# EAGLE design untitled (EAGLE 9.2.2)
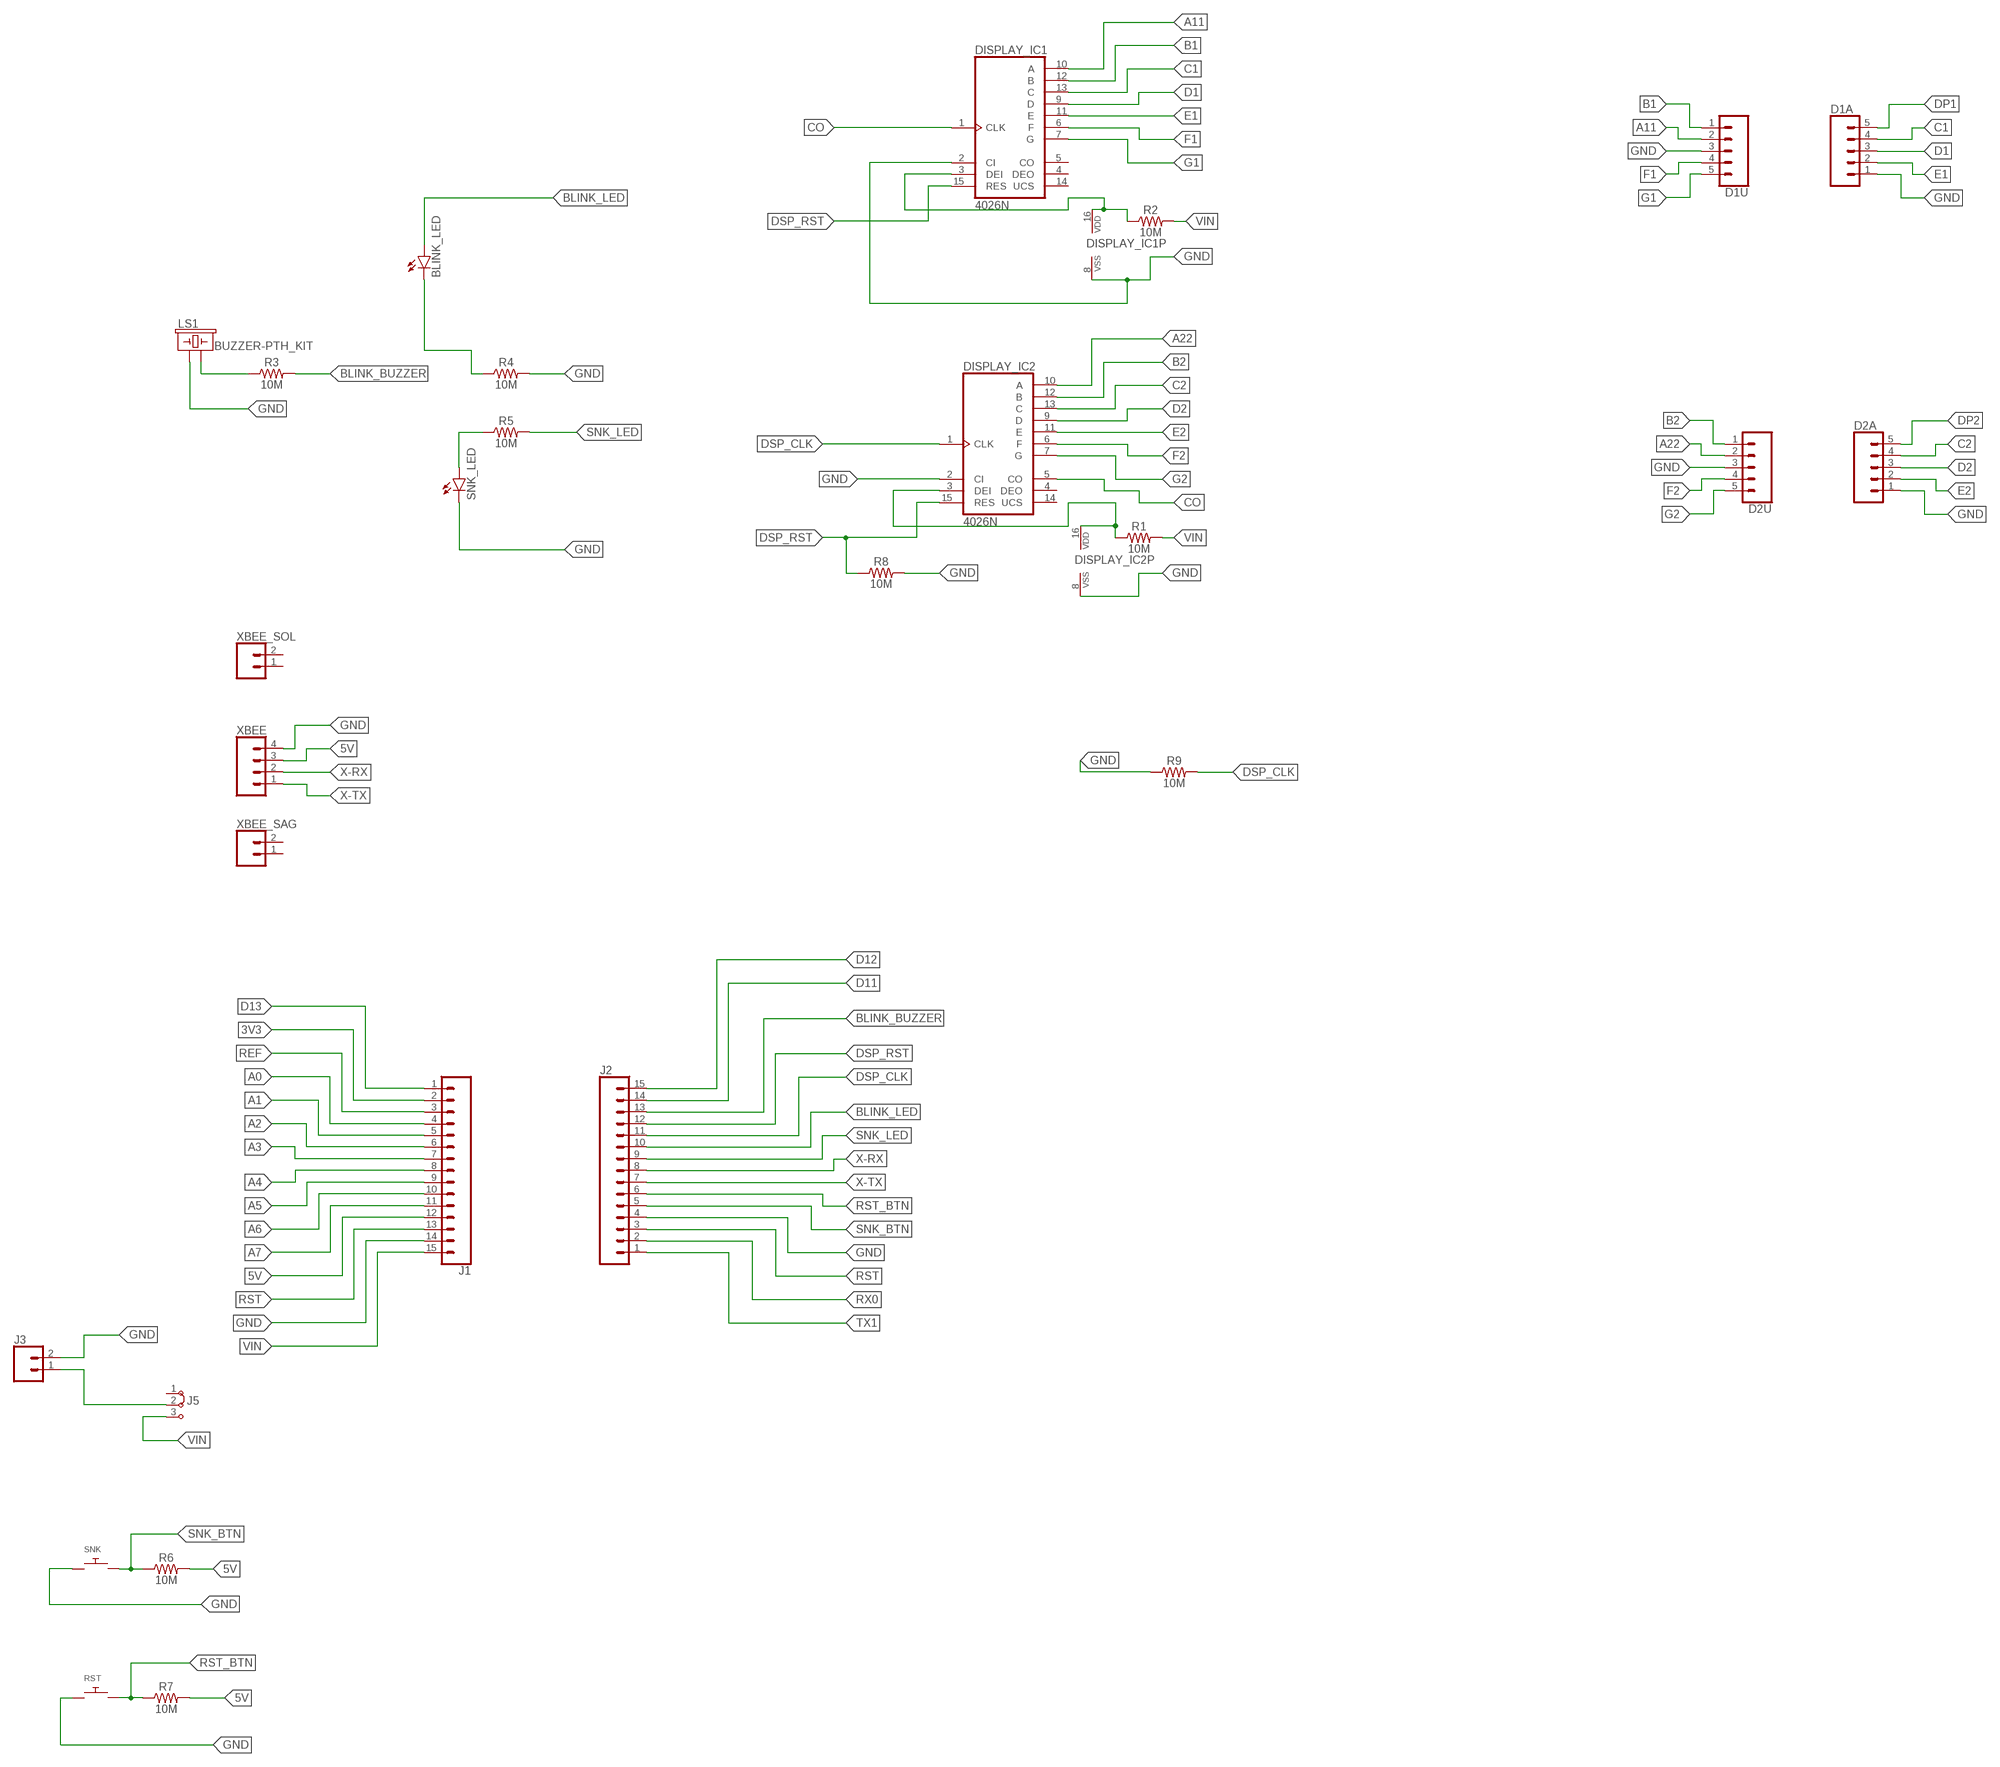
[diagram p0: schematic, sheet 1]

## Parts
BLINK_LED  LED5MM  [LED5MM]
D1A  CONN_05  [1X05]
D1U  CONN_05  [1X05]
D2A  CONN_05  [1X05]
D2U  CONN_05  [1X05]
DISPLAY_IC1  4026N  [DIL16]
DISPLAY_IC2  4026N  [DIL16]
J1  CONN_15  [1X15]
J2  CONN_15  [1X15]
J3  CONN_025MM  [SCREWTERMINAL-5MM-2]
J5  J2X2MM  [04C]
LS1  BUZZER-PTH_KIT  [BUZZER-12MM-KIT]
R1  10M  10MOHM-HORIZ-1/4W-5%  [AXIAL-0.3]
R2  10M  10MOHM-HORIZ-1/4W-5%  [AXIAL-0.3]
R3  10M  10MOHM-HORIZ-1/4W-5%  [AXIAL-0.3]
R4  10M  10MOHM-HORIZ-1/4W-5%  [AXIAL-0.3]
R5  10M  10MOHM-HORIZ-1/4W-5%  [AXIAL-0.3]
R6  10M  10MOHM-HORIZ-1/4W-5%  [AXIAL-0.3]
R7  10M  10MOHM-HORIZ-1/4W-5%  [AXIAL-0.3]
R8  10M  10MOHM-HORIZ-1/4W-5%  [AXIAL-0.3]
R9  10M  10MOHM-HORIZ-1/4W-5%  [AXIAL-0.3]
RST  SWITCH_PUSHBUTTONEVQ-PE  [TACT_PANA-EVQ]
SNK  SWITCH_PUSHBUTTONEVQ-PE  [TACT_PANA-EVQ]
SNK_LED  LED5MM  [LED5MM]
XBEE  CONN_04  [1X04]
XBEE_SAG  CONN_02  [1X02]
XBEE_SOL  CONN_02  [1X02]

## Nets
3V3: J1.2
5V: J1.12 R6.P$2 R7.P$2 XBEE.3
A0: J1.4
A1: J1.5
A2: J1.6
A3: J1.7
A4: J1.8
A5: J1.9
A6: J1.10
A7: J1.11
A11: D1U.2 DISPLAY_IC1.10(A)
A22: D2U.2 DISPLAY_IC2.10(A)
B1: D1U.1 DISPLAY_IC1.12(B)
B2: D2U.1 DISPLAY_IC2.12(B)
BLINK_BUZZER: J2.13 R3.P$2
BLINK_LED: BLINK_LED.A J2.10
BUZZER+: LS1.- R3.P$1
C1: D1A.4 DISPLAY_IC1.13(C)
C2: D2A.4 DISPLAY_IC2.13(C)
CO: DISPLAY_IC1.1(CLK) DISPLAY_IC2.5(CO)
D1: D1A.3 DISPLAY_IC1.9(D)
D2: D2A.3 DISPLAY_IC2.9(D)
D11: J2.14
D12: J2.15
D13: J1.1
DP1: D1A.5
DP2: D2A.5
DSP_CLK: DISPLAY_IC2.1(CLK) J2.11 R9.P$2
DSP_RST: DISPLAY_IC1.15(RES) DISPLAY_IC2.15(RES) J2.12 R8.P$1
E1: D1A.2 DISPLAY_IC1.11(E)
E2: D2A.2 DISPLAY_IC2.11(E)
F1: D1U.4 DISPLAY_IC1.6(F)
F2: D2U.4 DISPLAY_IC2.6(F)
G1: D1U.5 DISPLAY_IC1.7(G)
G2: D2U.5 DISPLAY_IC2.7(G)
GND: D1A.1 D1U.3 D2A.1 D2U.3 DISPLAY_IC1.2(CI) DISPLAY_IC1.8(VSS) DISPLAY_IC2.2(CI) DISPLAY_IC2.8(VSS) J1.14 J2.4 J3.2 LS1.+ R4.P$2 R8.P$2 R9.P$1 RST.P$1 SNK.P$1 SNK_LED.K(C) XBEE.4
N$2: R5.P$1 SNK_LED.A
N$5: BLINK_LED.K(C) R4.P$1
N$19: DISPLAY_IC2.3(DEI) DISPLAY_IC2.16(VDD) R1.P$1
N$20: DISPLAY_IC1.3(DEI) DISPLAY_IC1.16(VDD) R2.P$1
REF: J1.3
RST: J1.13 J2.3
RST_BTN: J2.6 R7.P$1 RST.P$2
RX0: J2.2
SNK_BTN: J2.5 R6.P$1 SNK.P$2
SNK_LED: J2.9 R5.P$2
TX1: J2.1
VGIRIS: J3.1 J5.2
VIN: J1.15 J5.3 R1.P$2 R2.P$2
X-RX: J2.8 XBEE.2
X-TX: J2.7 XBEE.1
Unconnected: DISPLAY_IC1.4(DEO) DISPLAY_IC1.5(CO) DISPLAY_IC1.14(UCS) DISPLAY_IC2.4(DEO) DISPLAY_IC2.14(UCS) J5.1 XBEE_SAG.1 XBEE_SAG.2 XBEE_SOL.1 XBEE_SOL.2

## Library data of the parts
BLINK_LED SNK_LED = led:LED: LED OSRAM: - CHIPLED LG R971, LG N971, LY N971, LG Q971, LY Q971, LO R971, LY R971 LH N974, LH R974 LS Q976, LO Q976, LY Q976 LO Q996 - Hyper CHIPLED LW Q18S LB Q993, LB Q99A, LB R99A - SideLED LS A670, LO A670, LY A670, LG A670, LP A670 LB A673, LV A673, LT A673, LW A673 LH A674 LY A675 LS A676, LA A676, LO A676, LY A676, LW A676 LS A679, LY A679, LG A679 - Hyper Micro SIDELED® LS Y876, LA Y876, LO Y876, LY Y876 LT Y87S - SmartLED LW L88C, LW L88S LB L89C, LB L89S, LG L890 LS L89K, LO L89K, LY L89K LS L896, LA L896, LO L896, LY L896 - TOPLED LS T670, LO T670, LY T670, LG T670, LP T670 LSG T670, LSP T670, LSY T670, LOP T670, LYG T670 LG T671, LOG T671, LSG T671 LB T673, LV T673, LT T673, LW T673 LH T674 LS T676, LA T676, LO T676, LY T676, LB T676, LH T676, LSB T676, LW T676 LB T67C, LV T67C, LT T67C, LS T67K, LO T67K, LY T67K, LW E67C LS E67B, LA E67B, LO E67B, LY E67B, LB E67C, LV E67C, LT E67C LW T67C LS T679, LY T679, LG T679 LS T770, LO T770, LY T770, LG T770, LP T770 LB T773, LV T773, LT T773, LW T773 LH T774 LS E675, LA E675, LY E675, LS T675 LS T776, LA T776, LO T776, LY T776, LB T776 LHGB T686 LT T68C, LB T68C - Hyper Mini TOPLED® LB M676 - Mini TOPLED Santana® LG M470 LS M47K, LO M47K, LY M47K Source: http://www.osram.convergy.de LUXEON: - LUMILED® LXK2-PW12-R00, LXK2-PW12-S00, LXK2-PW14-U00, LXK2-PW14-V00 LXK2-PM12-R00, LXK2-PM12-S00, LXK2-PM14-U00 LXK2-PE12-Q00, LXK2-PE12-R00, LXK2-PE12-S00, LXK2-PE14-T00, LXK2-PE14-U00 LXK2-PB12-K00, LXK2-PB12-L00, LXK2-PB12-M00, LXK2-PB14-N00, LXK2-PB14-P00, LXK2-PB14-Q00 LXK2-PR12-L00, LXK2-PR12-M00, LXK2-PR14-Q00, LXK2-PR14-R00 LXK2-PD12-Q00, LXK2-PD12-R00, LXK2-PD12-S00 LXK2-PH12-R00, LXK2-PH12-S00 LXK2-PL12-P00, LXK2-PL12-Q00, LXK2-PL12-R00 Source: www.luxeon.com KINGBRIGHT: KA-3528ASYC Source: www.kingbright.com
D1A D1U D2A D2U = SparkFun-Connectors:CONN_05: Multi connection point. Often used as Generic Header-pin footprint for 0.1 inch spaced/style header connections On any of the 0.1 inch spaced packages, you can populate with these: Break Away Headers - Straight <https://www.sparkfun.com/products/116> (PRT-00116) Break Away Male Headers - Right Angle <https://www.sparkfun.com/products/553> (PRT-00553) Female Headers <https://www.sparkfun.com/products/115> (PRT-00115) Break Away Headers - Machine Pin <https://www.sparkfun.com/products/117> (PRT-00117) Break Away Female Headers - Swiss Machine Pin <https://www.sparkfun.com/products/743> (PRT-00743) For SCREWTERMINALS and SPRING TERMINALS visit here: Screw Terimnals on SparkFun.com <https://www.sparkfun.com/search/results?term=Screw+Terminals> (5mm/3.5mm/2.54mm spacing) This device is also useful as a general connection point to wire up your design to another part of your project. Our various solder wires solder well into these plated through hole pads. Hook-Up Wire - Assortment (Stranded, 22 AWG) <https://www.sparkfun.com/products/11375> (PRT-11375) Hook-Up Wire - Assortment (Solid Core, 22 AWG) <https://www.sparkfun.com/products/11367> (PRT-11367) View the entire wire category on our website here <https://www.sparkfun.com/categories/141> Special notes: Molex polarized connector foot print use with SKU : PRT-08231 with associated crimp pins and housings. 1MM SMD Version SKU: PRT-10208
DISPLAY_IC1 DISPLAY_IC2 = 40xx:4026: Decade COUNTER/DIVIDER, 7-seg. outputs; SPICEPREFIX: X
J1 J2 = SparkFun-Connectors:CONN_15: Multi connection point. Often used as Generic Header-pin footprint for 0.1 inch spaced/style header connections On any of the 0.1 inch spaced packages, you can populate with these: Break Away Headers - Straight <https://www.sparkfun.com/products/116> (PRT-00116) Break Away Male Headers - Right Angle <https://www.sparkfun.com/products/553> (PRT-00553) Female Headers <https://www.sparkfun.com/products/115> (PRT-00115) Break Away Headers - Machine Pin <https://www.sparkfun.com/products/117> (PRT-00117) Break Away Female Headers - Swiss Machine Pin <https://www.sparkfun.com/products/743> (PRT-00743) For SCREWTERMINALS and SPRING TERMINALS visit here: Screw Terimnals on SparkFun.com <https://www.sparkfun.com/search/results?term=Screw+Terminals> (5mm/3.5mm/2.54mm spacing) This device is also useful as a general connection point to wire up your design to another part of your project. Our various solder wires solder well into these plated through hole pads. Hook-Up Wire - Assortment (Stranded, 22 AWG) <https://www.sparkfun.com/products/11375> (PRT-11375) Hook-Up Wire - Assortment (Solid Core, 22 AWG) <https://www.sparkfun.com/products/11367> (PRT-11367) View the entire wire category on our website here <https://www.sparkfun.com/categories/141> Special notes: Molex polarized connector foot print use with SKU : PRT-08231 with associated crimp pins and housings. 1MM SMD Version SKU: PRT-10208 NOTES ON THE VARIANTS LOCK and LOCK_LONGPADS... This footprint was designed to help hold the alignment of a through-hole component (i.e. 6-pin header) while soldering it into place. You may notice that each hole has been shifted either up or down by 0.005 of an inch from it's more standard position (which is a perfectly straight line). This slight alteration caused the pins (the squares in the middle) to touch the edges of the holes. Because they are alternating, it causes a "brace" to hold the component in place. 0.005 has proven to be the perfect amount of "off-center" position when using our standard breakaway headers. Although looks a little odd when you look at the bare footprint, once you have a header in there, the alteration is very hard to notice. Also,if you push a header all the way into place, it is covered up entirely on the bottom side.
J3 = SparkFun-Connectors:CONN_02: Multi connection point. Often used as Generic Header-pin footprint for 0.1 inch spaced/style header connections On any of the 0.1 inch spaced packages, you can populate with these: Break Away Headers - Straight <https://www.sparkfun.com/products/116> (PRT-00116) Break Away Male Headers - Right Angle <https://www.sparkfun.com/products/553> (PRT-00553) Female Headers <https://www.sparkfun.com/products/115> (PRT-00115) Break Away Headers - Machine Pin <https://www.sparkfun.com/products/117> (PRT-00117) Break Away Female Headers - Swiss Machine Pin <https://www.sparkfun.com/products/743> (PRT-00743) For SCREWTERMINALS and SPRING TERMINALS visit here: Screw Terimnals on SparkFun.com <https://www.sparkfun.com/search/results?term=Screw+Terminals> (5mm/3.5mm/2.54mm spacing) This device is also useful as a general connection point to wire up your design to another part of your project. Our various solder wires solder well into these plated through hole pads. Hook-Up Wire - Assortment (Stranded, 22 AWG) <https://www.sparkfun.com/products/11375> (PRT-11375) Hook-Up Wire - Assortment (Solid Core, 22 AWG) <https://www.sparkfun.com/products/11367> (PRT-11367) View the entire wire category on our website here <https://www.sparkfun.com/categories/141> Special notes: Molex polarized connector foot print use with: PRT-08233 with associated crimp pins and housings. 2.54_SCREWTERM for use with PRT-10571. 3.5mm Screw Terminal footprints for PRT-08084 5mm Screw Terminal footprints for use with PRT-08432; SF_SKU: PRT-08432
J5 = jumper:J2: Jumper switch 2 x 2.5 mm
LS1 = SparkFun-Electromechanical:BUZZER: Buzzer Small round buzzers that operate around the audible 2kHz range. You can use these as speakers to create simple music or user interfaces. Variant Overview: PTH - Mini Speaker - PC Mount 12mm 2.048kHz <https://www.sparkfun.com/products/7950> PTH_KIT - Mini Speaker - PC Mount 12mm 2.048kHz <https://www.sparkfun.com/products/7950> KIT simplifies soldering by adding stop mask to one side of the pads. PTH_NO_SILK - Mini Speaker - PC Mount 12mm 2.048kHz <https://www.sparkfun.com/products/7950> No silkscreen indicator of buzzer outline. PTH_KIT_NO_SILK - Mini Speaker - PC Mount 12mm 2.048kHz <https://www.sparkfun.com/products/7950> KIT package w/o silkscreen SMD - Buzzer Audio Magnetic (CCV-084B16) SMD buzzer used on, e.g. the LilyPad Buzzer <https://www.sparkfun.com/products/8463> and RFID USB Reader <https://www.sparkfun.com/products/9963>. SMD_KIT - Buzzer Audio Magnetic (CCV-084B16) SMD Buzzer with elongated pins to make soldering easier. Used on the SparkFun Simon Says - Surface Mount Soldering Kit <https://www.sparkfun.com/products/10935>.; PROD_ID: COMP-08253; SF_SKU: COM-07950
R1-R9 = SparkFun-Resistors:10MOHM: RES-09327; PROD_ID: RES-09327
RST SNK = adafruit:SWITCH_PUSHBUTTON: Buttons SOFTTOUCHSMD_SJ - Soft touch temporary push button (Super Junk Akihabara) Compatible with SKPMANE010 [Mouser: 688-SKPMAN] C&K_KSS = Digikey: KSS221GLFS
XBEE = SparkFun-Connectors:CONN_04: Multi connection point. Often used as Generic Header-pin footprint for 0.1 inch spaced/style header connections On any of the 0.1 inch spaced packages, you can populate with these: Break Away Headers - Straight <https://www.sparkfun.com/products/116> (PRT-00116) Break Away Male Headers - Right Angle <https://www.sparkfun.com/products/553> (PRT-00553) Female Headers <https://www.sparkfun.com/products/115> (PRT-00115) Break Away Headers - Machine Pin <https://www.sparkfun.com/products/117> (PRT-00117) Break Away Female Headers - Swiss Machine Pin <https://www.sparkfun.com/products/743> (PRT-00743) For SCREWTERMINALS and SPRING TERMINALS visit here: Screw Terimnals on SparkFun.com <https://www.sparkfun.com/search/results?term=Screw+Terminals> (5mm/3.5mm/2.54mm spacing) This device is also useful as a general connection point to wire up your design to another part of your project. Our various solder wires solder well into these plated through hole pads. Hook-Up Wire - Assortment (Stranded, 22 AWG) <https://www.sparkfun.com/products/11375> (PRT-11375) Hook-Up Wire - Assortment (Solid Core, 22 AWG) <https://www.sparkfun.com/products/11367> (PRT-11367) View the entire wire category on our website here <https://www.sparkfun.com/categories/141> Special notes: Molex polarized connector foot print use with SKU : PRT-08231 with associated crimp pins and housings. 1MM SMD Version SKU: PRT-10208; PROD_ID: CONN-09696
XBEE_SAG XBEE_SOL = SparkFun-Connectors:CONN_02: Multi connection point. Often used as Generic Header-pin footprint for 0.1 inch spaced/style header connections On any of the 0.1 inch spaced packages, you can populate with these: Break Away Headers - Straight <https://www.sparkfun.com/products/116> (PRT-00116) Break Away Male Headers - Right Angle <https://www.sparkfun.com/products/553> (PRT-00553) Female Headers <https://www.sparkfun.com/products/115> (PRT-00115) Break Away Headers - Machine Pin <https://www.sparkfun.com/products/117> (PRT-00117) Break Away Female Headers - Swiss Machine Pin <https://www.sparkfun.com/products/743> (PRT-00743) For SCREWTERMINALS and SPRING TERMINALS visit here: Screw Terimnals on SparkFun.com <https://www.sparkfun.com/search/results?term=Screw+Terminals> (5mm/3.5mm/2.54mm spacing) This device is also useful as a general connection point to wire up your design to another part of your project. Our various solder wires solder well into these plated through hole pads. Hook-Up Wire - Assortment (Stranded, 22 AWG) <https://www.sparkfun.com/products/11375> (PRT-11375) Hook-Up Wire - Assortment (Solid Core, 22 AWG) <https://www.sparkfun.com/products/11367> (PRT-11367) View the entire wire category on our website here <https://www.sparkfun.com/categories/141> Special notes: Molex polarized connector foot print use with: PRT-08233 with associated crimp pins and housings. 2.54_SCREWTERM for use with PRT-10571. 3.5mm Screw Terminal footprints for PRT-08084 5mm Screw Terminal footprints for use with PRT-08432

## Board
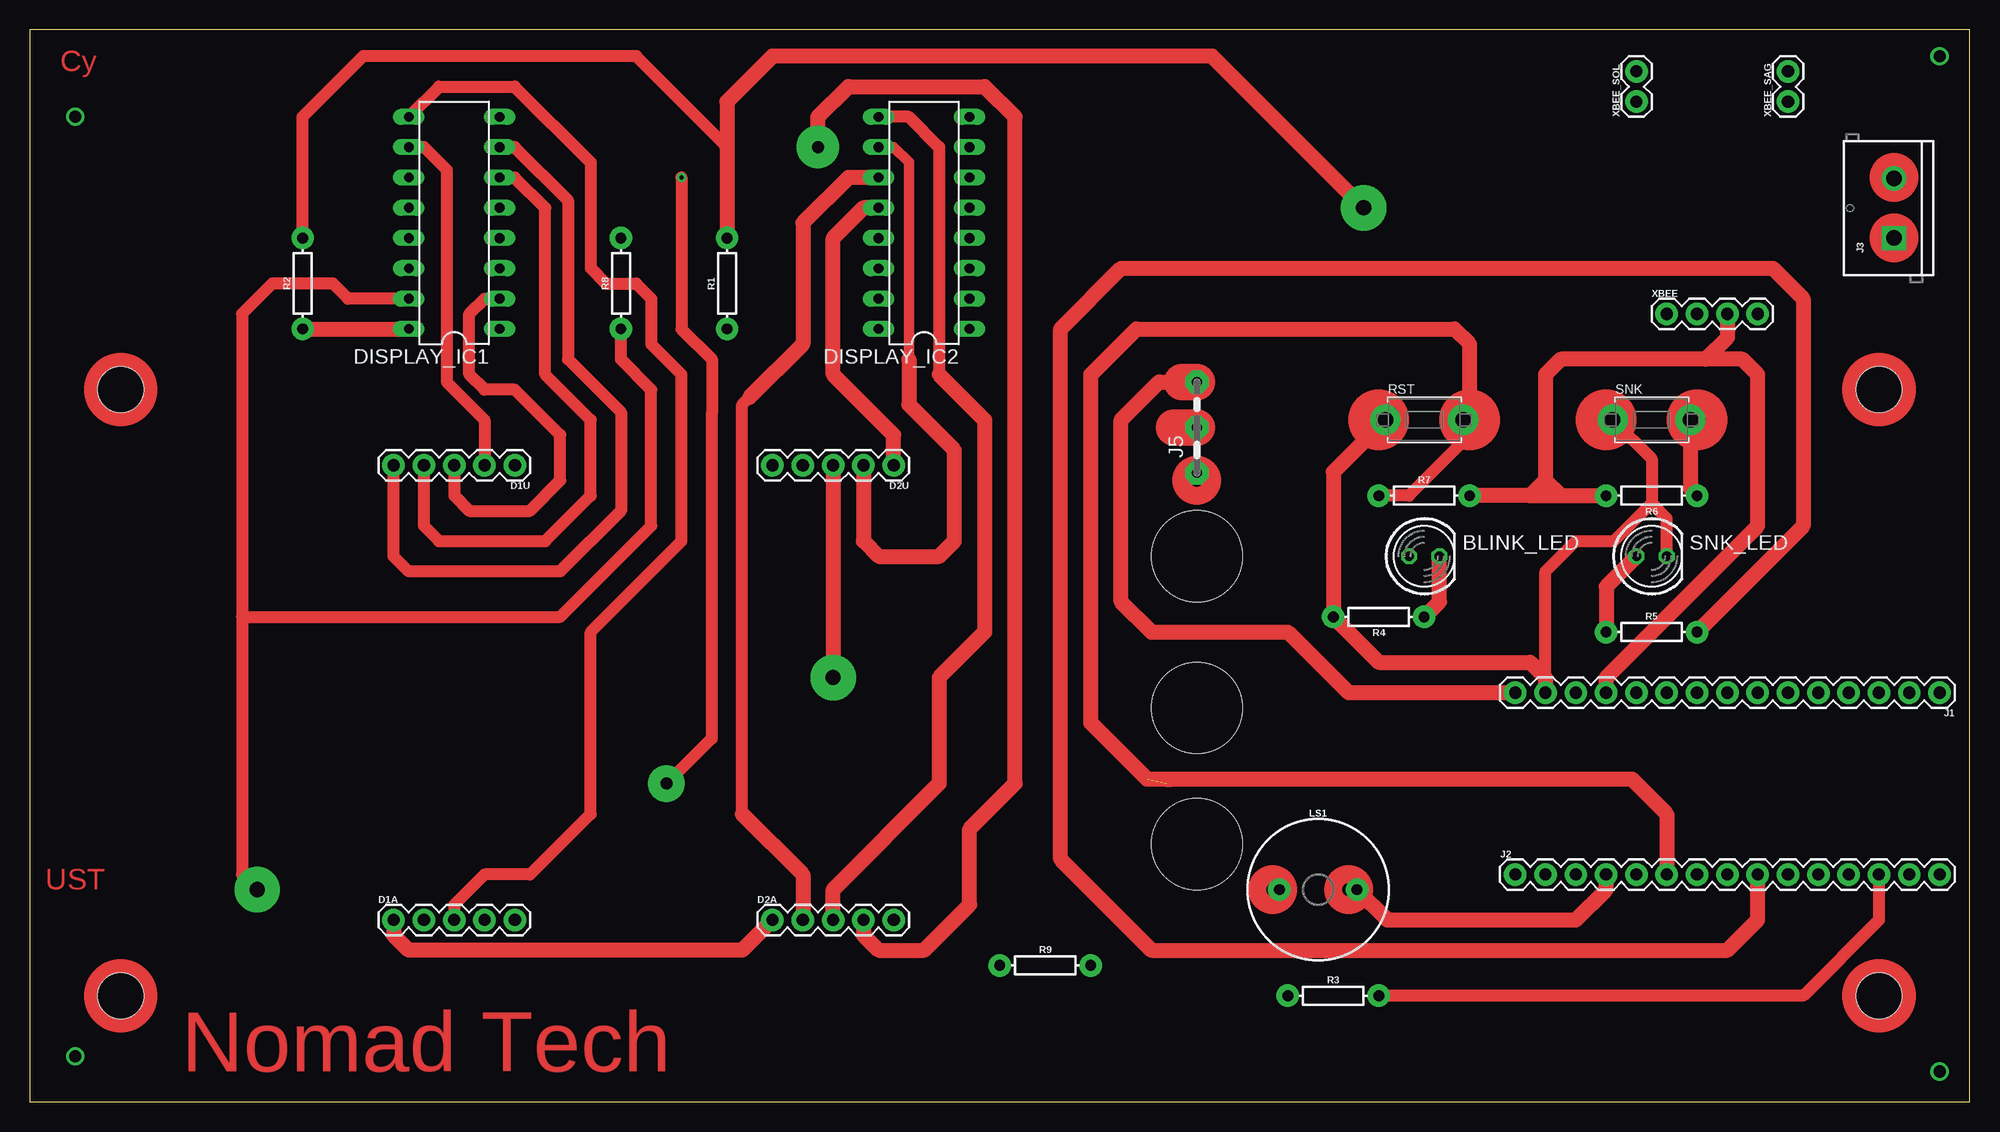
[diagram p1: board, top side]
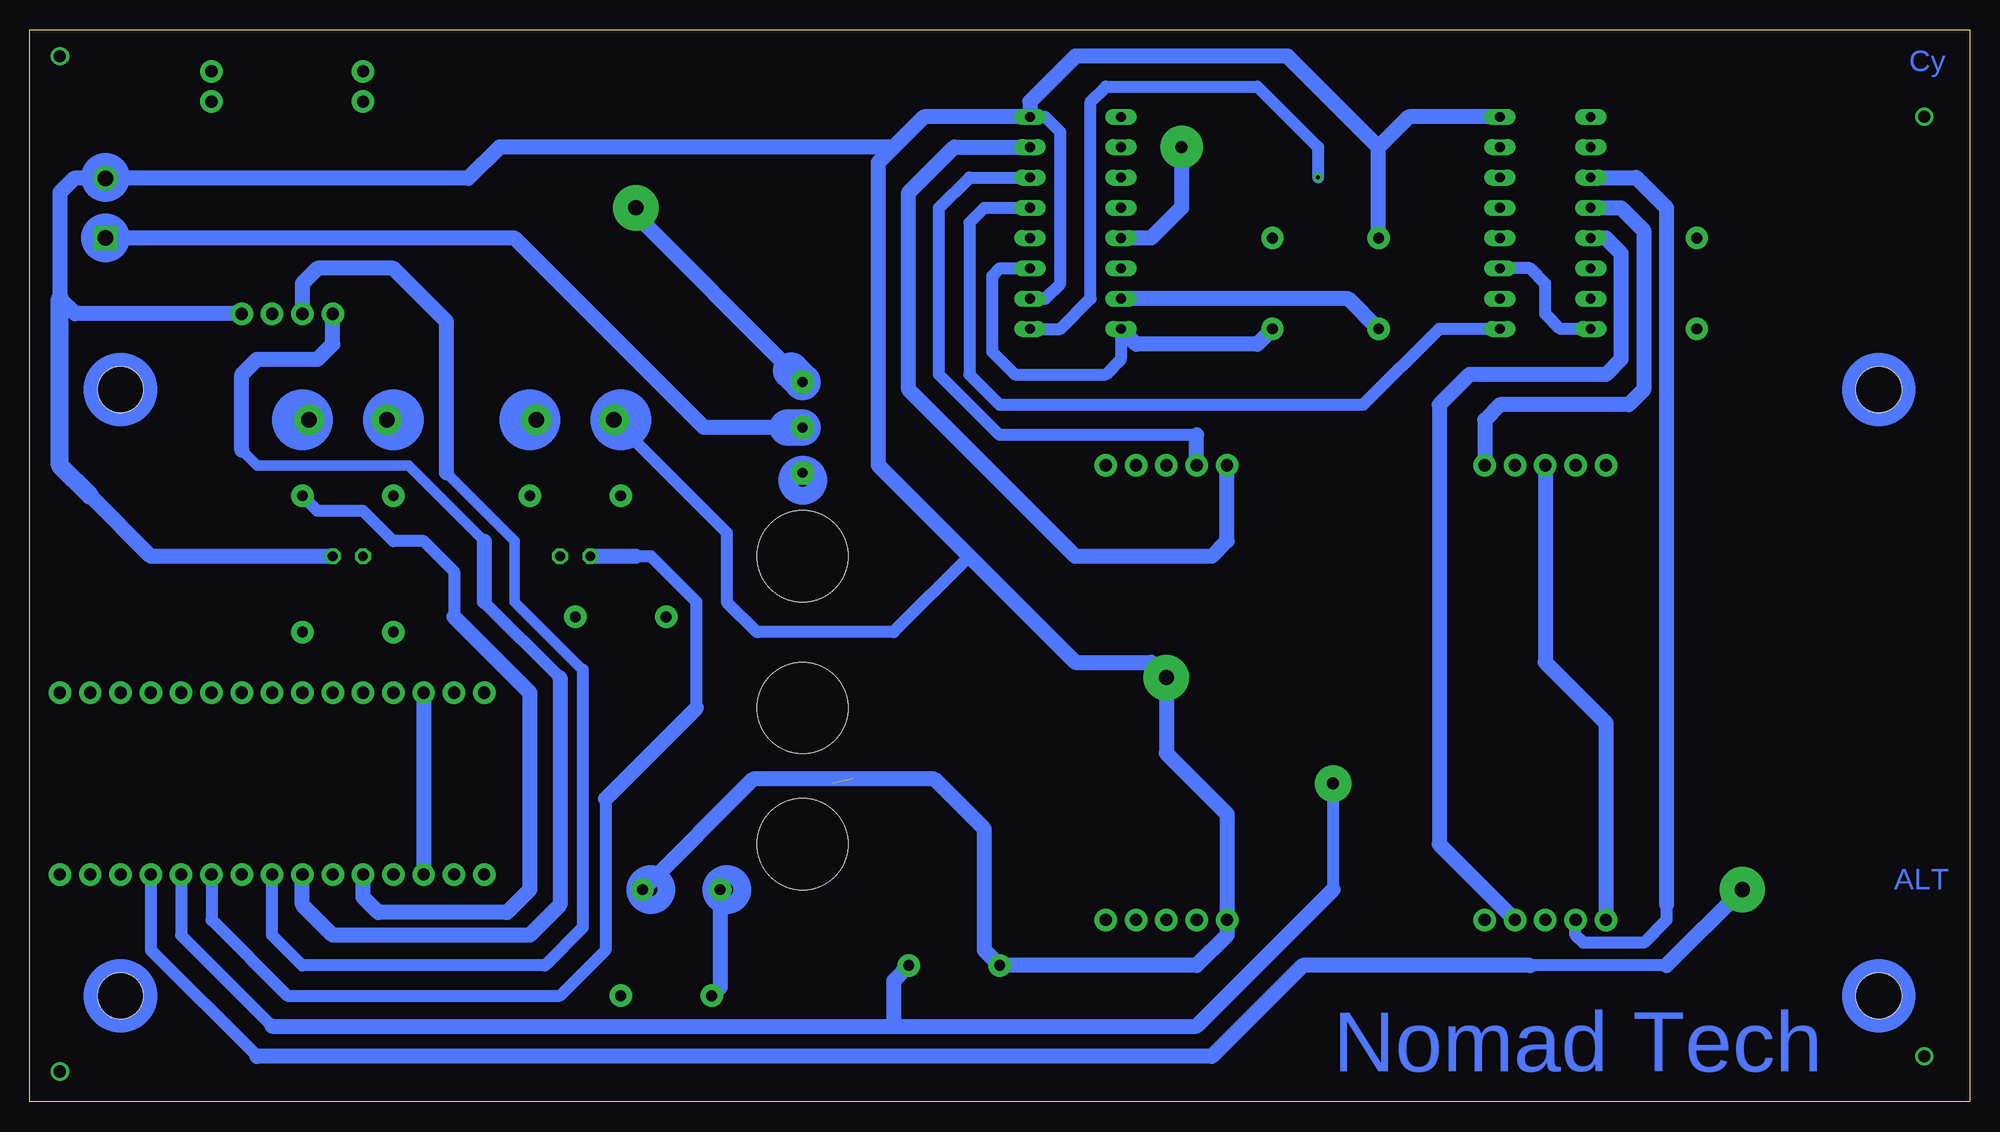
[diagram p2: board, bottom side, seen from below]

Size 162.54 x 89.84 mm. Coordinates in mm from the lower left corner, seen from the top.
Outline: 0,0 162.54,0 162.54,89.84 0,89.84 0,0
Copper layers (1*16): Top 0.035mm / dielectric 1.5mm / Bottom 0.035mm
Design rules "default": minimum track width 6mil, minimum drill 0.35mm, track to track 6mil, track to pad 6mil, pad to pad 6mil, via to via 6mil, smd to smd 6mil, copper to edge 40mil, drill to drill 6mil, minimum pad ring 10mil, minimum via ring 8mil, stop-mask expansion 4mil, vias tented up to drill 0mil, thermal gap 10mil
Holes 3.81 mm at 7.62,8.89 154.94,8.89 7.62,59.69 154.94,59.69
Holes 7.62 mm at 97.79,45.72 97.79,33.02 97.79,21.59

### Footprints (pad centres in the part's own frame; a part is rotated, then mirrored left to right if it is on the bottom)
LED5MM = drill 0.813 octagon: A -1.27,0; K 1.27,0
1X05 = drill 1.016 pad 1.88: 1 0,0; 2 2.54,0; 3 5.08,0; 4 7.62,0; 5 10.16,0
DIL16 = drill 0.813 long: 1 -8.89,-3.81; 2 -6.35,-3.81; 3 -3.81,-3.81; 4 -1.27,-3.81; 5 1.27,-3.81; 6 3.81,-3.81; 7 6.35,-3.81; 8 8.89,-3.81; 9 8.89,3.81; 10 6.35,3.81; 11 3.81,3.81; 12 1.27,3.81; 13 -1.27,3.81; 14 -3.81,3.81; 15 -6.35,3.81; 16 -8.89,3.81
1X15 = drill 1.016 pad 1.88: 1 0,0; 2 2.54,0; 3 5.08,0; 4 7.62,0; 5 10.16,0; 6 12.7,0; 7 15.24,0; 8 17.78,0; 9 20.32,0; 10 22.86,0; 11 25.4,0; 12 27.94,0; 13 30.48,0; 14 33.02,0; 15 35.56,0
SCREWTERMINAL-5MM-2 = drill 1.3 pad 2.032 square: 1 0,0 | drill 1.3 pad 2.032: 2 5,0
04C = drill 0.813 pad 1.905 octagon: 1 -1.905,0; 2 1.905,0; 3 5.715,0
BUZZER-12MM-KIT = drill 0.9 pad 1.88: + 3.25,0; - -3.25,0
AXIAL-0.3 = drill 0.9 pad 1.88: P$1 -3.81,0; P$2 3.81,0
TACT_PANA-EVQ = drill 1.3 pad 2.54: P$1 -3.25,0; P$2 3.25,0
1X04 = drill 1.016 pad 1.88: 1 0,0; 2 2.54,0; 3 5.08,0; 4 7.62,0
1X02 = drill 1.016 pad 1.88: 1 0,0; 2 2.54,0

### Placement (x,y rotation side)
BLINK_LED  116.84,45.72 0 top
D1A  30.48,15.24 0 top
D1U  40.64,53.34 180 top
D2A  62.23,15.24 0 top
D2U  72.39,53.34 180 top
DISPLAY_IC1  35.56,73.66 90 top
DISPLAY_IC2  74.93,73.66 90 top
J1  160.02,34.29 180 top
J2  124.46,19.05 0 top
J3  156.21,72.39 90 top
J5  97.79,54.61 90 top
LS1  107.95,17.78 0 top
R1  58.42,68.58 90 top
R2  22.86,68.58 90 top
R3  109.22,8.89 0 top
R4  113.03,40.64 180 top
R5  135.89,39.37 0 top
R6  135.89,50.8 180 top
R7  116.84,50.8 0 top
R8  49.53,68.58 90 top
R9  85.09,11.43 0 top
RST  116.84,57.15 0 top
SNK  135.89,57.15 0 top
SNK_LED  135.89,45.72 0 top
XBEE  137.16,66.04 0 top
XBEE_SAG  147.32,83.82 90 top
XBEE_SOL  134.62,83.82 90 top

### Tracks (layer width: path | path; a pad name or v marks a point on that pad's centre or on a via)
5V
  Top 1.27: J1.12 132.08,35.56 144.78,48.26 144.78,50.8 144.78,51.51 144.78,60.96 143.51,62.23 140.41,62.23 | XBEE.3 142.24,64.06 140.41,62.23 | 127,52.07 125.73,50.8 | 125.73,50.8 R7.P$2 | 140.41,62.23 128.27,62.23 127,60.96 127,52.07 | 125.73,50.8 128.27,50.8 | 128.27,50.8 R6.P$2 | 128.27,50.8 127,52.07
A11
  Top 1.016: DISPLAY_IC1.10 33.02,80.01 34.93,78.11 34.93,60.32 38.1,57.15 D1U.2
A22
  Top 0.889: DISPLAY_IC2.10 72.39,80.01 73.66,78.74 73.66,62.23
  Top 1.27: 73.66,62.23 73.66,58.42 77.47,54.61 77.47,46.99 76.2,45.72 71.12,45.72 69.85,46.99 D2U.2
B1
  Bottom 1.27: DISPLAY_IC1.12 29.21,74.93 27.3,73.03 27.3,59.69 28.57,58.42 39.37,58.42 40.64,57.15 D1U.1
B2
  Top 1.27: DISPLAY_IC2.12 69.85,74.93 67.31,72.39 67.31,60.96 72.39,55.88 D2U.1
BLINK_BUZZER
  Top 1.016: J2.13 154.94,15.24 148.59,8.89 R3.P$2
BLINK_LED
  Bottom 1.016: 114.3,25.4 114.3,12.7 118.11,8.89 140.97,8.89 147.32,15.24 J2.10 | 106.68,33.02 106.68,41.91 110.49,45.72 111.76,45.72
  Bottom 1.27: 106.68,33.02 114.3,25.4 | 111.76,45.72 BLINK_LED.A
BUZZER+
  Bottom 1.27: LS1.- 104.7,9.6 R3.P$1
C1
  Bottom 1.27: D1A.4 44.45,21.59 44.45,58.42 41.91,60.96 30.48,60.96 29.21,62.23 29.21,71.12 30.48,72.39 DISPLAY_IC1.13
C2  (via drill 1.02 pad 3.56)
  Top 1.27: v66.04,80.01 66.04,82.55 68.58,85.09 80.01,85.09 82.55,82.55 82.55,26.67 78.74,22.86 78.74,16.51 74.93,12.7 71.12,12.7 69.85,13.97 D2A.4
  Bottom 1.27: v66.04,80.01 66.04,74.93 68.58,72.39 DISPLAY_IC2.13
CO
  Bottom 1.016: DISPLAY_IC1.1 44.45,64.77 50.8,58.42 81.28,58.42 83.82,60.96 83.82,73.66 82.55,74.93 DISPLAY_IC2.5
D1
  Top 1.016: DISPLAY_IC1.9 34.29,85.09 40.64,85.09 46.99,78.74 46.99,69.85 48.26,68.58 50.8,68.58 52.07,67.31 52.07,63.5 54.61,60.96 54.61,46.99 46.99,39.37 46.99,24.13 41.91,19.05 38.1,19.05 35.56,16.51 D1A.3
D2
  Top 1.016: 76.2,60.96 76.2,80.01 73.66,82.55 DISPLAY_IC2.9
  Top 1.27: D2A.3 67.31,17.78 76.2,26.67 76.2,35.56 80.01,39.37 80.01,57.15 76.2,60.96
DSP_CLK  (via drill 0.35, 1.02 pad 3.05)
  Top 1.016: v53.34,26.67 57.12,30.46 57.12,57.69 57.15,57.71 57.15,62.23 54.61,64.77 v54.61,77.47
  Bottom 1.016: J2.11 149.86,13.97 142.24,6.35 | DISPLAY_IC2.1 76.2,64.77 73.66,67.31 73.66,83.82 72.39,85.09 59.69,85.09 54.61,80.01 v54.61,77.47 | v53.34,26.67 53.34,17.78
  Bottom 1.27: 53.34,17.78 64.77,6.35 90.17,6.35 | 142.24,6.35 90.17,6.35 | R9.P$2 90.17,10.16 90.17,6.35
DSP_RST  (via drill 1.27 pad 3.81)
  Top 1.016: DISPLAY_IC1.15 26.67,67.31 25.4,68.58 20.32,68.58 17.78,66.04 17.78,40.64 | 17.78,40.64 17.78,19.05 v19.05,17.78 | R8.P$1 49.53,62.23 52.07,59.69 52.07,48.26 44.45,40.64 17.78,40.64
  Bottom 1.016: J2.12 152.4,12.7 143.51,3.81 | 25.4,11.43 36.83,11.43
  Bottom 1.27: R8.P$1 52.07,67.31 DISPLAY_IC2.15 | v19.05,17.78 25.4,11.43 | 36.83,11.43 55.88,11.43 63.5,3.81 143.51,3.81
E1
  Bottom 1.016: D1A.2 33.02,13.97 32.38,13.34 27.3,13.34 25.4,15.24 25.4,16.51
  Bottom 1.27: DISPLAY_IC1.11 27.94,77.47 25.4,74.93 25.4,16.51
E2
  Top 1.016: 60.33,59.05 59.69,58.42 59.69,24.13
  Top 1.27: DISPLAY_IC2.11 68.58,77.47 64.77,73.66 64.77,63.5 60.33,59.05 | 59.69,24.13 64.77,19.05 D2A.2
F1
  Top 0.635: 40.64,77.47 DISPLAY_IC1.6
  Top 1.016: 40.64,77.47 43.18,74.93 43.18,60.96 46.99,57.15 46.99,50.8 43.18,46.99 34.29,46.99 33.02,48.26 D1U.4
F2
  Bottom 1.016: 64.77,55.88 81.28,55.88 86.36,60.96 86.36,74.93 83.82,77.47 DISPLAY_IC2.6
  Bottom 1.27: D2U.4 64.77,55.88
G1
  Top 1.016: DISPLAY_IC1.7 40.64,80.01 45.09,75.56 45.09,62.23 49.53,57.78 49.53,49.53 44.45,44.45 31.75,44.45 30.48,45.72 D1U.5
G2
  Bottom 1.27: D2U.5 62.23,46.99 63.5,45.72 74.93,45.72 88.9,59.69 88.9,76.2 85.09,80.01 DISPLAY_IC2.7
GND  (via drill 1.27 pad 3.81)
  Top 1.016: D1U.3 35.56,50.8 36.83,49.53 41.91,49.53 44.45,52.07 44.45,55.88 40.64,59.69 38.1,59.69 36.83,60.96 36.83,66.04 38.1,67.31 DISPLAY_IC1.2 | J1.14 127,44.45 129.54,46.99 132.72,46.99 135.89,50.16 | SNK.P$1 135.89,53.9 135.89,50.16 | 135.89,50.16 137.16,48.89 SNK_LED.K
  Top 1.27: D1A.1 30.48,13.97 31.75,12.7 59.69,12.7 D2A.1 | J1.14 127,35.56 125.73,36.83 113.03,36.83 R4.P$2 109.22,52.78 RST.P$1 | LS1.+ 113.74,15.24 129.54,15.24 132.08,17.78 J2.4 | D2U.3 v67.31,35.56
  Bottom 1.016: DISPLAY_IC2.8 77.47,82.55 76.2,81.28 76.2,68.58 77.47,67.31 DISPLAY_IC2.2 | 83.82,45.72 90.17,39.37 101.6,39.37 104.14,41.91 104.14,47.7 RST.P$1
  Bottom 1.27: R8.P$2 49.53,80.01 | 49.53,80.01 46.99,82.55 DISPLAY_IC1.8 | 49.53,80.01 57.15,87.63 74.93,87.63 78.74,83.82 DISPLAY_IC2.8 87.63,82.55 90.17,80.01 | D1A.1 30.48,31.75 35.56,36.83 D1U.3 | LS1.+ 101.93,27.05 86.74,27.05 82.55,22.86 82.55,12.7 R9.P$1 64.77,11.43 62.23,13.97 D2A.1 62.23,24.13 67.31,29.21 v67.31,35.56 68.58,36.83 74.93,36.83 83.82,45.72 91.44,53.34 91.44,78.74 90.17,80.01 | XBEE.4 158.75,66.04 160.02,67.31 160.02,76.2 158.83,77.39 J3.2 125.81,77.39 123.19,80.01 90.17,80.01 | 157.48,50.8 152.4,45.72 SNK_LED.K
  Bottom 1.524: 157.48,50.8 160.02,53.34 160.02,67.31
N$1  (via drill 1.02)
  other vias: 3.81,82.55
N$2
  Top 1.27: SNK_LED.A 132.08,43.18 R5.P$1
N$3  (via drill 1.02)
  other vias: 3.81,3.81
N$4  (via drill 1.02)
  other vias: 160.02,2.54
N$5
  Top 1.27: R4.P$1 118.11,41.91 BLINK_LED.K
N$6  (via drill 1.02)
  other vias: 160.02,87.63
N$19
  Bottom 1.016: DISPLAY_IC2.16 71.12,62.23 72.39,60.96 80.01,60.96 81.91,62.87 81.91,69.22 81.28,69.85 DISPLAY_IC2.3
  Bottom 1.27: R1.P$1 59.69,63.5 69.85,63.5 DISPLAY_IC2.16
N$20
  Top 1.27: R2.P$1 DISPLAY_IC1.16
  Bottom 1.016: DISPLAY_IC1.16 34.29,64.77 35.56,66.04 35.56,68.58 36.83,69.85 DISPLAY_IC1.3
RST
  Bottom 1.27: J1.13 J2.3
RST_BTN  (1 unrouted)
  Top 0.635: 95.25,26.67 95.6,26.67 95.66,26.73 125.73,26.73 | 134.56,26.73 137.16,24.13
  Top 1.016: R7.P$1 115.57,50.8 120.09,55.32
  Top 1.27: J2.6 137.16,24.13 134.24,27.05 93.6,27.05 88.9,31.75 88.9,60.96 92.71,64.77 119.38,64.77 120.65,63.5 120.65,57.71 RST.P$2 120.09,55.32
SNK_BTN
  Top 1.27: SNK.P$2 139.14,51.36 R6.P$1
  Bottom 1.016: R6.P$1 138.43,49.53 134.62,49.53 132.08,46.99 129.54,46.99 127,44.45 127,40.64
  Bottom 1.27: 127,40.64 120.65,34.29 120.65,17.78 122.55,15.88 133.35,15.88 134.62,17.14 J2.5
SNK_LED
  Top 1.27: R5.P$2 148.59,48.26 148.59,67.31 146.05,69.85 91.44,69.85 86.36,64.77 86.36,20.32 93.98,12.7 142.24,12.7 144.78,15.24 J2.9
VGIRIS
  Top 3.048: J5.2 95.88,56.51
  Bottom 1.27: J3.1 121.92,72.39 106.04,56.51 102.87,56.51 99.06,56.51
  Bottom 3.048: J5.2 99.06,56.51
VIN  (via drill 1.27 pad 3.81)
  Top 1.016: R2.P$2 22.86,82.55 27.94,87.63 50.8,87.63 58.42,80.01
  Top 1.27: 96.52,60.32 94.61,60.32 91.44,57.15 91.44,41.91 93.98,39.37 96.52,39.37 105.41,39.37 110.49,34.29 J1.15 | v111.76,74.93 99.06,87.63 62.23,87.63 58.42,83.82 58.42,80.01 R1.P$2
  Top 3.048: 96.52,60.32 J5.3
  Bottom 1.27: 98.74,61.28 111.76,74.3 v111.76,74.93
  Bottom 3.048: J5.3 98.74,61.28
X-RX
  Bottom 0.889: 127.64,52.7 121.92,46.99 121.92,41.91 116.2,36.2
  Bottom 1.016: 116.2,36.2 116.2,14.61 119.38,11.43 139.7,11.43 142.24,13.97 J2.8
  Bottom 1.27: 127.64,52.7 127.64,65.41 132.08,69.85 138.43,69.85 139.7,68.58 XBEE.2
X-TX
  Bottom 0.889: 124.46,46.99 130.81,53.34 143.51,53.34 144.78,54.61
  Bottom 1.016: 124.46,41.91 118.11,35.56
  Bottom 1.27: 124.46,46.99 124.46,41.91 | 118.11,35.56 118.11,16.51 120.65,13.97 137.16,13.97 139.7,16.51 J2.7 | XBEE.1 137.16,63.5 138.43,62.23 143.51,62.23 144.78,60.96 144.78,54.61
(copper drawn outside any net)
  shapes: Bottom circle x16, Top circle x16

### Text on the board
Top: Cy | UST | Nomad Tech
Bottom: Cy | ALT | Nomad Tech